# Altium project PSoC GPIO Board.PrjPcb
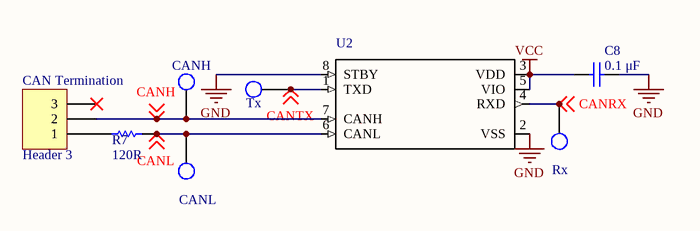
[diagram p0: CAN.SchDoc]
2 sheets, 16 parts. Net scope: global (net labels, ports and power ports of the same name join across sheets).
Board file: GPIO Unit Rev 1.PcbDoc
Sheets:
  CAN.SchDoc
  LEDs.SchDoc

## Sheet CAN.SchDoc
size A

### Parts
C8  0.1 μF  [Cap 0805]
CAN_Termination  Header 3  [HDR1X3]
CANH  Test Point  [Test Point pad]  (value not drawn)
CANL  Test Point  [Test Point pad]  (value not drawn)
R7  120R  [RESC0805(2012)_N]
Rx  Test Point  [Test Point Through-hole]  (value not drawn)
Tx  Test Point  [Test Point Through-hole]  (value not drawn)
U2  MCP2562-E/SN  [SOIC127P600X175-8N]  (value not drawn)

### Nets
GND: C8.2 U2.2(VSS) U2.8(STBY)
VCC: C8.1 U2.3(VDD) U2.5(VIO)
CANH: CAN_Termination.2 CANH.1 U2.7(CANH) ; off-sheet CANH
CANL: CANL.1 R7.1 U2.6(CANL) ; off-sheet CANL
CANRX: Rx.1 U2.4(RXD) ; off-sheet CANRX
CANTX: Tx.1 U2.1(TXD) ; off-sheet CANTX
NetCAN_Termination_1: CAN_Termination.1 R7.2

Not connected (* = marked no-connect by the designer): CAN_Termination 3*

### Notes on the sheet
- Title
- Size:
- Date:
- A
- Number:
- Time:
- Revision:
- Sheet
- of
- File:

### Library data of the parts
C8 = Capacitor 0805: Standard Capacitor; Mounting Technology: SurfaceMount; Case Size/Dimension: 0805; Package Reference: 0805; Capacitance: 0.1 μF
CAN_Termination = Header 3: Header, 3-Pin; LatestRevisionDate: 17-Jul-2002; LatestRevisionNote: Re-released for DXP Platform.; Publisher: Altium Limited
R7 = Resistor 0805: Generic 0805 Resistor; Tolerance: 5 %; Case-Metric: 2012; Case-EIA: 0805; Power: 0.125 W; Technology: SMT; Value: 120R
U2 = CAN Tranceiver: Microchip MCP2562-E/SN, CAN Transceiver 1MBps 1-channel IEC 61000-4-2, 8-Pin SOIC; Price: None; MF: Microchip; SnapEDA_Link: https://www.snapeda.com/parts/MCP2562-E/SN/Microchip/view-part/?ref=snap; MP: MCP2562-E/SN; Availability: Unavailable; Package: SO-8 Microchip; Value: *

## Sheet LEDs.SchDoc
size A
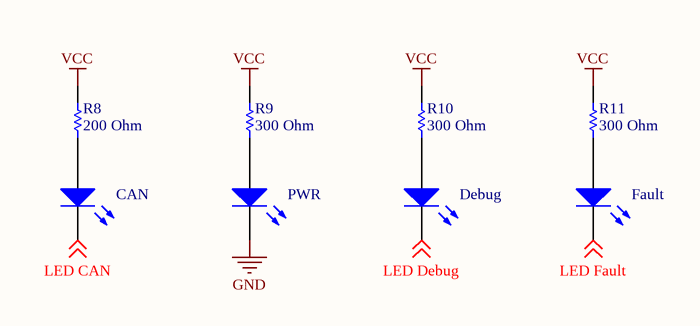
[diagram p1: LEDs.SchDoc]

### Parts
CAN  LED  [0805_A]  (value not drawn)
Debug  LED  [0805_A]  (value not drawn)
Fault  LED  [0805_A]  (value not drawn)
PWR  LED  [0805_A]  (value not drawn)
R8  200 Ohm  [RESC0805(2012)_N]
R9  300 Ohm  [RESC0805(2012)_N]
R10  300 Ohm  [RESC0805(2012)_N]
R11  300 Ohm  [RESC0805(2012)_N]

### Nets
GND: PWR.1(K)
VCC: R8.1 R9.1 R10.1 R11.1
LED CAN: CAN.1(K) ; off-sheet LED CAN
LED Debug: Debug.1(K) ; off-sheet LED Debug
LED Fault: Fault.1(K) ; off-sheet LED Fault
NetCAN_2: CAN.2(A) R8.2
NetDebug_2: Debug.2(A) R10.2
NetFault_2: Fault.2(A) R11.2
NetPWR_2: PWR.2(A) R9.2

### Notes on the sheet
- Title
- Size:
- Date:
- A
- Number:
- Time:
- Revision:
- Sheet
- of
- File:

### Library data of the parts
CAN Fault = LED: Standard 0805 LED; Manufacturer: Wuerth Elektronik; PartNumber: 150080SS75000; PackageReference: 0805_A
  CAN: Color: Blue
  Fault: ComponentLink2URL: http://katalog.we-online.com/led/datasheet/150080SS75000.pdf; ComponentLink1URL: http://www.we-online.com; Color: Super Red; ComponentLink2Description: Datasheet; ComponentLink1Description: Manufacturer URL
Debug PWR = LED: Standard 0805 LED; PackageReference: 0805_A
  Debug: Color: Green
  PWR: Color: Yellow
R8-R11 = Resistor 0805: Generic 0805 Resistor; Value: 120R; Case-EIA: 0805; Tolerance: 5 %; Case-Metric: 2012; Power: 0.125 W; Technology: SMT

## Nets that join several sheets
GND: CAN (C8.2 U2.2 U2.8), LEDs (PWR.1)
VCC: CAN (C8.1 U2.3 U2.5), LEDs (R8.1 R9.1 R10.1 R11.1)